# EasyEDA Pro project Tb66_and_DRV88_Teensy_LFR_PCB.epro, board Connected
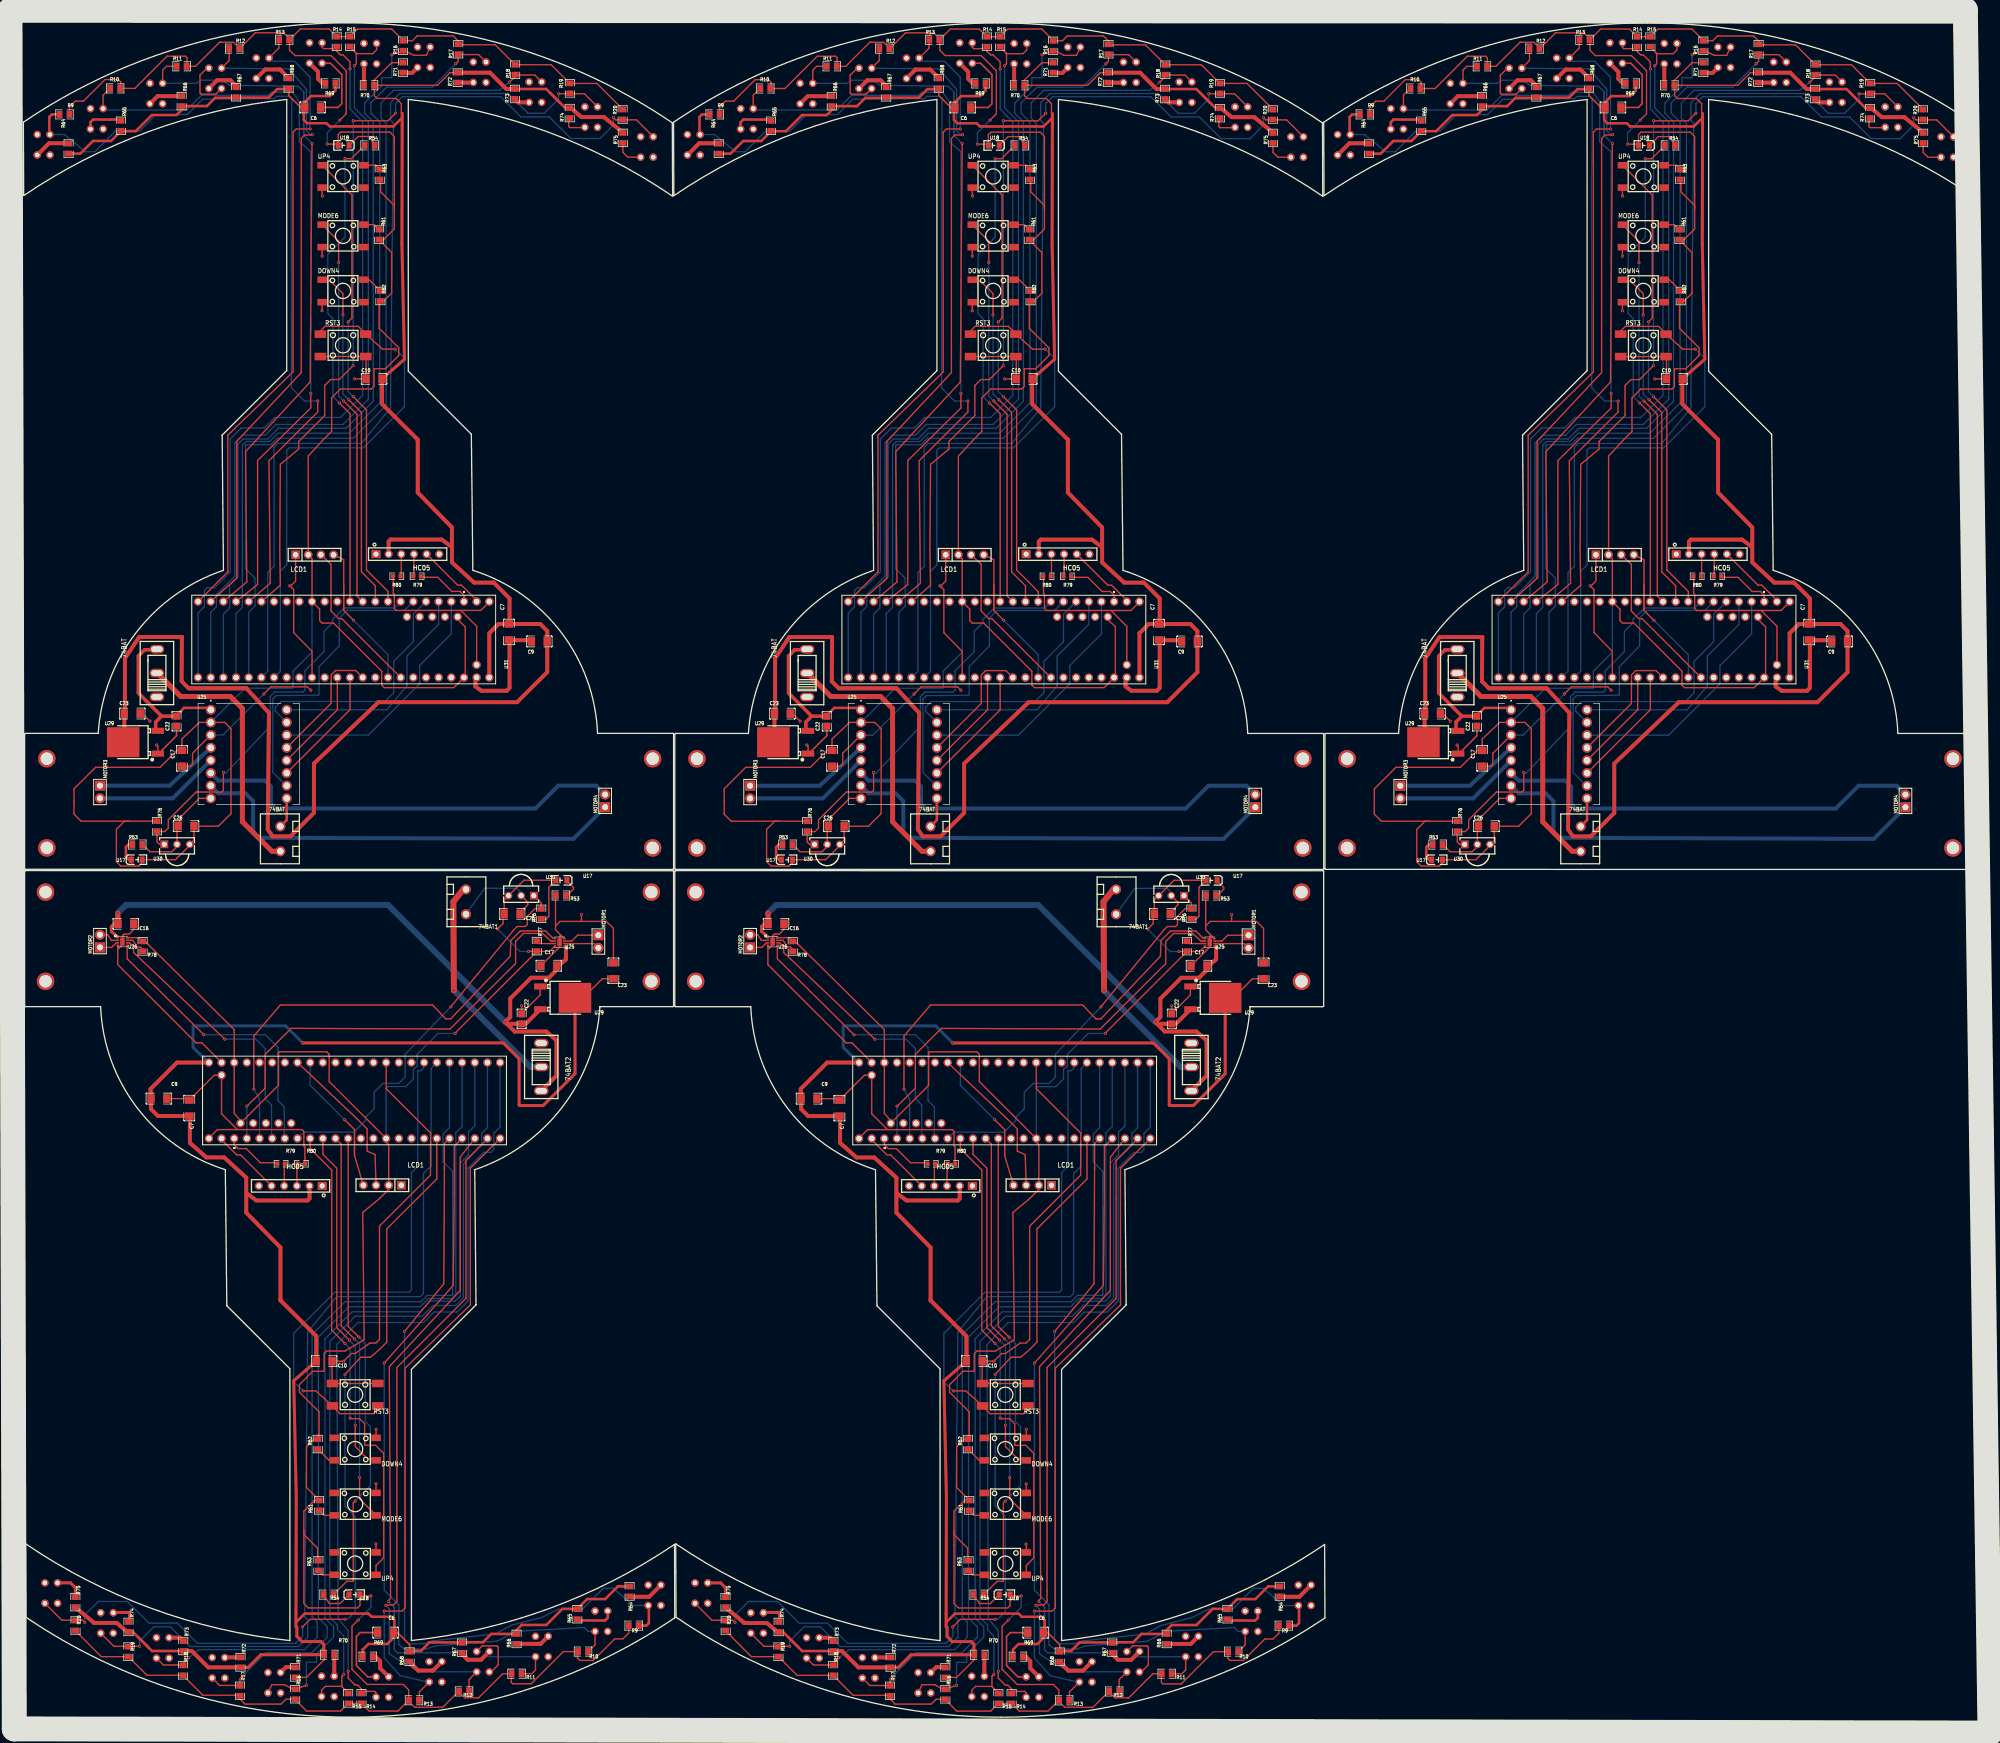
[diagram p4: board, top side]
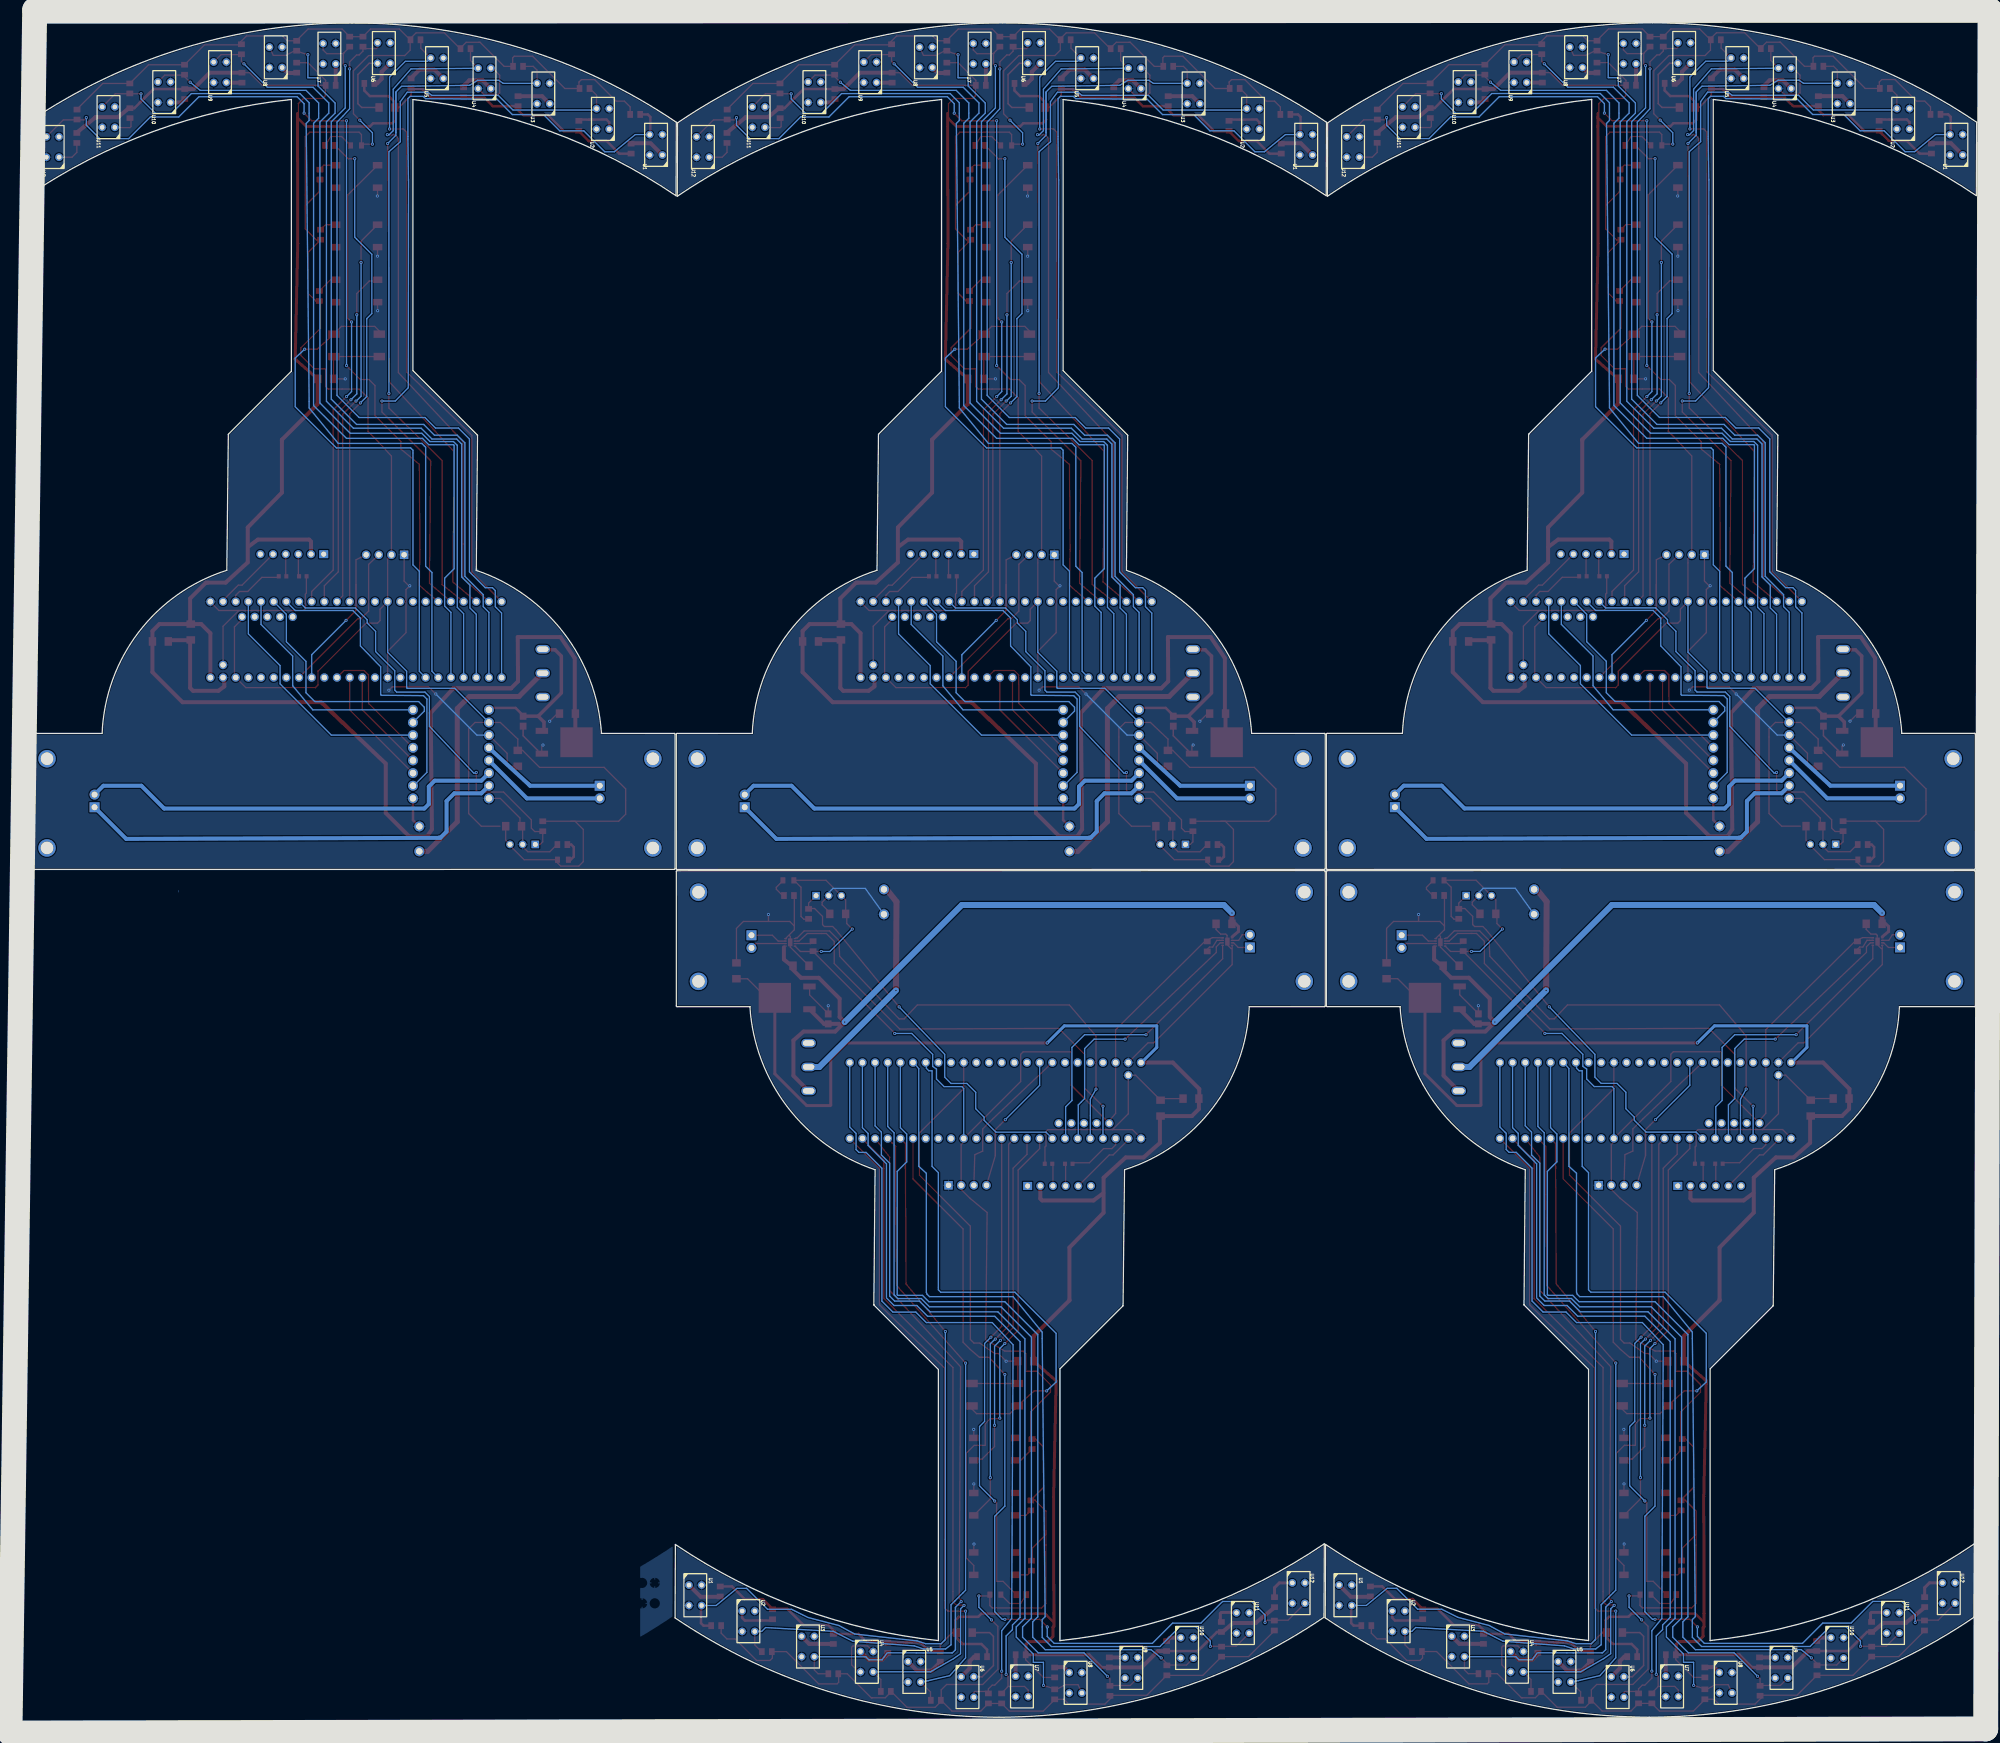
[diagram p5: board, bottom side, seen from below]

Outline 397.23 x 345.87 mm; copper layers: Top Layer, Bottom Layer. Coordinates in mm from the lower left corner of the outline.
Stack: Top Layer 0.035mm / Dielectric1 1.51mm FR4 er 4.5 / Bottom Layer 0.035mm

## Design rules (mm)
template: JLCPCB Capability(Two Layers Board)
spacing copperThickness1oz (default): track to track 0.102, other pairs 0.152 to 0.3
spacing copperThickness2oz: track to track 0.203, other pairs 0.152 to 0.3
track width copperThickness1oz (default): min 0.127, default 0.254, max 2.54
track width copperThickness2oz: min 0.203, default 0.254, max 2.54
differential pair differentialPair (default): width min 0.127, default 0.254, max 2.54; gap min 0.152, default 0.152
via viaSize (default): diameter min 0.5, default 0.61, max 10; hole min 0.3, default 0.305, max 6.3

## Placement (name value [footprint] x y rotation side)
74BAT  -  [CONN-TH_WJ126V-5.0-2P]  54.25 179.49 180 top
74BAT1  -  [CONN-TH_WJ126V-5.0-2P]  91.47 166.85 0 top
74BAT1#2  -  [CONN-TH_WJ126V-5.0-2P]  221.9 166.84 0 top
74BAT2  -  [SW-TH_SHOU-HAN_SS12D10G4]  106.58 133.7 270 top
74BAT2#2  -  [SW-TH_SHOU-HAN_SS12D10G4]  237.01 133.69 270 top
74BAT#2  -  [CONN-TH_WJ126V-5.0-2P]  184.68 179.48 180 top
74BAT#3  -  [CONN-TH_WJ126V-5.0-2P]  315.11 179.48 180 top
74BAT#4  -  [SW-TH_SHOU-HAN_SS12D10G4]  29.48 212.77 90 top
74BAT#5  -  [SW-TH_SHOU-HAN_SS12D10G4]  159.91 212.76 90 top
74BAT#6  -  [SW-TH_SHOU-HAN_SS12D10G4]  290.35 212.75 90 top
C6  -  [C1206]  60.72 326.3 180 top
C6#2  -  [C1206]  191.16 326.29 180 top
C6#3  -  [C1206]  321.59 326.29 180 top
C6#4  -  [C1206]  75.34 20.16 0 top
C6#5  -  [C1206]  205.77 20.16 0 top
C7  -  [C1206]  100.09 221.02 90 top
C7#2  -  [C1206]  230.53 221.01 90 top
C7#3  -  [C1206]  360.96 221.01 90 top
C7#4  -  [C1206]  35.97 125.45 270 top
C7#5  -  [C1206]  166.4 125.44 270 top
C9  -  [C1206]  106.19 219.12 0 top
C9#2  -  [C1206]  236.62 219.11 0 top
C9#3  -  [C1206]  367.06 219.1 0 top
C9#4  -  [C1206]  29.87 127.35 180 top
C9#5  -  [C1206]  160.3 127.34 180 top
C10  -  [C1206]  73.04 271.82 0 top
C10#2  -  [C1206]  203.48 271.81 0 top
C10#3  -  [C1206]  333.91 271.81 0 top
C10#4  -  [C1206]  63.02 74.65 180 top
C10#5  -  [C1206]  193.45 74.64 180 top
C16  -  [C1206]  23.25 162.44 180 top
C16#2  -  [C1206]  153.68 162.43 180 top
C17  -  [C1206]  34.48 195.66 90 top
C17#2  -  [C1206]  164.92 195.65 90 top
C17#3  -  [C1206]  295.35 195.65 90 top
C17#4  -  [C1206]  108.11 154.02 0 top
C17#5  -  [C1206]  238.54 154.01 0 top
C22  -  [C0805]  33.42 203.11 90 top
C22#2  -  [C0805]  163.85 203.1 90 top
C22#3  -  [C0805]  294.28 203.1 90 top
C22#4  -  [C0805]  102.64 143.35 270 top
C22#5  -  [C0805]  233.08 143.35 270 top
C23  -  [C1206]  24.53 204.64 180 top
C23#2  -  [C1206]  154.96 204.63 180 top
C23#3  -  [C1206]  285.39 204.63 180 top
C23#4  -  [C1206]  121.06 153.01 270 top
C23#5  -  [C1206]  251.49 153 270 top
C26  -  [C1206]  35.32 182.03 0 top
C26#2  -  [C1206]  165.76 182.02 0 top
C26#3  -  [C1206]  296.19 182.02 0 top
C26#4  -  [C1206]  100.74 164.44 180 top
C26#5  -  [C1206]  231.17 164.43 180 top
DOWN4  -  [KEY-SMD_4P-L6.0-W6.0-P4.50-LS9.0]  66.82 289.47 0 top
DOWN4#2  -  [KEY-SMD_4P-L6.0-W6.0-P4.50-LS9.0]  197.25 289.46 0 top
DOWN4#3  -  [KEY-SMD_4P-L6.0-W6.0-P4.50-LS9.0]  327.69 289.46 0 top
DOWN4#4  -  [KEY-SMD_4P-L6.0-W6.0-P4.50-LS9.0]  69.24 56.99 180 top
DOWN4#5  -  [KEY-SMD_4P-L6.0-W6.0-P4.50-LS9.0]  199.67 56.99 180 top
HC05  -  [HDR-TH_6P-P2.54-V-F]  79.77 236.64 0 top
HC05#2  -  [HDR-TH_6P-P2.54-V-F]  210.21 236.63 0 top
HC05#3  -  [HDR-TH_6P-P2.54-V-F]  340.64 236.63 0 top
HC05#4  -  [HDR-TH_6P-P2.54-V-F]  56.29 109.83 180 top
HC05#5  -  [HDR-TH_6P-P2.54-V-F]  186.72 109.82 180 top
LCD1  -  [HDR-TH_4P-P2.54-V-F]  61.11 236.51 0 top
LCD1#2  -  [HDR-TH_4P-P2.54-V-F]  191.54 236.5 0 top
LCD1#3  -  [HDR-TH_4P-P2.54-V-F]  321.97 236.5 0 top
LCD1#4  -  [HDR-TH_4P-P2.54-V-F]  74.7 109.95 180 top
LCD1#5  -  [HDR-TH_4P-P2.54-V-F]  205.14 109.94 180 top
MODE6  -  [KEY-SMD_4P-L6.0-W6.0-P4.50-LS9.0]  66.82 300.52 0 top
MODE6#2  -  [KEY-SMD_4P-L6.0-W6.0-P4.50-LS9.0]  197.25 300.51 0 top
MODE6#3  -  [KEY-SMD_4P-L6.0-W6.0-P4.50-LS9.0]  327.69 300.51 0 top
MODE6#4  -  [KEY-SMD_4P-L6.0-W6.0-P4.50-LS9.0]  69.24 45.95 180 top
MODE6#5  -  [KEY-SMD_4P-L6.0-W6.0-P4.50-LS9.0]  199.67 45.94 180 top
MOTOR1  -  [HDR-TH_2P-P2.54-V-M]  118.04 158.87 270 top
MOTOR1#2  -  [HDR-TH_2P-P2.54-V-M]  248.47 158.86 270 top
MOTOR2  -  [HDR-TH_2P-P2.54-V-M]  18.05 158.97 90 top
MOTOR2#2  -  [HDR-TH_2P-P2.54-V-M]  148.48 158.96 90 top
MOTOR3  -  [HDR-TH_2P-P2.54-V-M]  18.05 188.89 270 top
MOTOR3#2  -  [HDR-TH_2P-P2.54-V-M]  148.48 188.88 270 top
MOTOR3#3  -  [HDR-TH_2P-P2.54-V-M]  278.92 188.88 270 top
MOTOR4  -  [HDR-TH_2P-P2.54-V-M]  119.4 187.11 90 top
MOTOR4#2  -  [HDR-TH_2P-P2.54-V-M]  249.83 187.1 90 top
MOTOR4#3  -  [HDR-TH_2P-P2.54-V-M]  380.26 187.1 90 top
NOREF  -  [Pad_e3127]  137.82 177.66 0 top
NOREF#2  -  [Pad_e7287]  137.56 150.88 180 top
NOREF#3  -  [Pad_e2550]  128.93 177.67 0 top
NOREF#4  -  [Pad_e2548]  7.39 177.67 0 top
NOREF#5  -  [Pad_e5893]  128.67 150.89 180 top
NOREF#6  -  [Pad_e2549]  7.39 195.58 0 top
NOREF#7  -  [Pad_e4669]  389.8 177.66 0 top
NOREF#8  -  [Pad_e3128]  137.82 195.57 0 top
NOREF#9  -  [Pad_e3130]  259.36 195.57 0 top
NOREF#10  -  [Pad_e5895]  7.13 168.8 180 top
NOREF#11  -  [Pad_e2551]  128.93 195.58 0 top
NOREF#12  -  [Pad_e7285]  259.1 168.79 180 top
NOREF#13  -  [Pad_e7288]  137.56 168.79 180 top
NOREF#14  -  [Pad_e5894]  7.13 150.89 180 top
NOREF#15  -  [Pad_e7286]  259.1 150.88 180 top
NOREF#16  -  [Pad_e3129]  259.36 177.66 0 top
NOREF#17  -  [Pad_e4667]  268.26 177.66 0 top
NOREF#18  -  [Pad_e4668]  268.26 195.57 0 top
NOREF#19  -  [Pad_e4670]  389.8 195.57 0 top
NOREF#20  -  [Pad_e5892]  128.67 168.8 180 top
R9  -  [R0805]  10.94 324.91 180 top
R9#2  -  [R0805]  141.37 324.9 180 top
R9#3  -  [R0805]  271.81 324.9 180 top
R9#4  -  [R0805]  125.12 21.56 0 top
R9#5  -  [R0805]  255.55 21.55 0 top
R10  -  [R0805]  21.1 330.11 0 top
R10#2  -  [R0805]  151.53 330.1 0 top
R10#3  -  [R0805]  281.97 330.1 0 top
R10#4  -  [R0805]  114.96 16.35 180 top
R10#5  -  [R0805]  245.39 16.35 180 top
R11  -  [R0805]  34.44 334.56 0 top
R11#2  -  [R0805]  164.87 334.55 0 top
R11#3  -  [R0805]  295.3 334.55 0 top
R11#4  -  [R0805]  101.63 11.91 180 top
R11#5  -  [R0805]  232.06 11.9 180 top
R12  -  [R0805]  44.98 338.11 180 top
R12#2  -  [R0805]  175.41 338.1 180 top
R12#3  -  [R0805]  305.84 338.1 180 top
R12#4  -  [R0805]  91.09 8.35 0 top
R12#5  -  [R0805]  221.52 8.34 0 top
R13  -  [R0805]  55.01 339.89 0 top
R13#2  -  [R0805]  185.44 339.88 0 top
R13#3  -  [R0805]  315.87 339.88 0 top
R13#4  -  [R0805]  81.05 6.58 180 top
R13#5  -  [R0805]  211.49 6.57 180 top
R14  -  [R0805]  65.55 339.51 90 top
R14#2  -  [R0805]  195.98 339.5 90 top
R14#3  -  [R0805]  326.42 339.5 90 top
R14#4  -  [R0805]  70.51 6.96 270 top
R14#5  -  [R0805]  200.94 6.95 270 top
R15  -  [R0805]  68.22 339.51 270 top
R15#2  -  [R0805]  198.65 339.5 270 top
R15#3  -  [R0805]  329.08 339.5 270 top
R15#4  -  [R0805]  67.85 6.96 90 top
R15#5  -  [R0805]  198.28 6.95 90 top
R16  -  [R0805]  78.85 338.69 90 top
R16#2  -  [R0805]  209.28 338.68 90 top
R16#3  -  [R0805]  339.71 338.68 90 top
R16#4  -  [R0805]  57.22 7.78 270 top
R16#5  -  [R0805]  187.65 7.77 270 top
R17  -  [R0805]  89.93 337.99 90 top
R17#2  -  [R0805]  220.37 337.98 90 top
R17#3  -  [R0805]  350.8 337.98 90 top
R17#4  -  [R0805]  46.13 8.48 270 top
R17#5  -  [R0805]  176.56 8.47 270 top
R18  -  [R0805]  101.35 333.88 270 top
R18#2  -  [R0805]  231.78 333.87 270 top
R18#3  -  [R0805]  362.21 333.87 270 top
R18#4  -  [R0805]  34.72 12.59 90 top
R18#5  -  [R0805]  165.15 12.58 90 top
R19  -  [R0805]  112.32 330.13 90 top
R19#2  -  [R0805]  242.75 330.12 90 top
R19#3  -  [R0805]  23.74 16.34 270 top
R19#4  -  [R0805]  373.19 330.11 90 top
R19#5  -  [R0805]  154.17 16.33 270 top
R20  -  [R0805]  122.91 324.88 90 top
R20#2  -  [R0805]  253.34 324.87 90 top
R20#3  -  [R0805]  383.77 324.87 90 top
R20#4  -  [R0805]  13.15 21.58 270 top
R20#5  -  [R0805]  143.59 21.58 270 top
R53  -  [R0805]  25.55 178.35 180 top
R53#2  -  [R0805]  155.98 178.34 180 top
R53#3  -  [R0805]  286.41 178.34 180 top
R53#4  -  [R0805]  110.52 168.12 0 top
R53#5  -  [R0805]  240.95 168.11 0 top
R54  -  [R0805]  72.15 318.68 0 top
R54#2  -  [R0805]  202.59 318.67 0 top
R54#3  -  [R0805]  333.02 318.67 0 top
R54#4  -  [R0805]  63.91 27.78 180 top
R54#5  -  [R0805]  194.34 27.78 180 top
R61  -  [R0805]  74.06 300.78 270 top
R61#2  -  [R0805]  204.49 300.77 270 top
R61#3  -  [R0805]  334.92 300.77 270 top
R61#4  -  [R0805]  62 45.69 90 top
R61#5  -  [R0805]  192.44 45.68 90 top
R62  -  [R0805]  74.31 288.46 90 top
R62#2  -  [R0805]  204.75 288.45 90 top
R62#3  -  [R0805]  335.18 288.45 90 top
R62#4  -  [R0805]  61.75 58.01 270 top
R62#5  -  [R0805]  192.18 58 270 top
R63  -  [R0805]  74.19 312.84 270 top
R63#2  -  [R0805]  204.62 312.83 270 top
R63#3  -  [R0805]  335.05 312.83 270 top
R63#4  -  [R0805]  61.88 33.63 90 top
R63#5  -  [R0805]  192.31 33.62 90 top
R64  -  [R0805]  11.76 318.04 270 top
R64#2  -  [R0805]  142.19 318.03 270 top
R64#3  -  [R0805]  272.62 318.03 270 top
R64#4  -  [R0805]  124.31 28.42 90 top
R64#5  -  [R0805]  254.74 28.41 90 top
R65  -  [R0805]  22.24 322.62 270 top
R65#2  -  [R0805]  152.68 322.61 270 top
R65#3  -  [R0805]  283.11 322.61 270 top
R65#4  -  [R0805]  113.82 23.85 90 top
R65#5  -  [R0805]  244.25 23.84 90 top
R66  -  [R0805]  34.44 327.57 270 top
R66#2  -  [R0805]  164.87 327.56 270 top
R66#3  -  [R0805]  295.3 327.56 270 top
R66#4  -  [R0805]  101.63 18.89 90 top
R66#5  -  [R0805]  232.06 18.89 90 top
R67  -  [R0805]  45.36 329.35 270 top
R67#2  -  [R0805]  175.79 329.34 270 top
R67#3  -  [R0805]  306.22 329.34 270 top
R67#4  -  [R0805]  90.71 17.12 90 top
R67#5  -  [R0805]  221.14 17.11 90 top
R68  -  [R0805]  55.9 331.13 270 top
R68#2  -  [R0805]  186.33 331.12 270 top
R68#3  -  [R0805]  316.76 331.12 270 top
R68#4  -  [R0805]  80.17 15.34 90 top
R68#5  -  [R0805]  210.6 15.33 90 top
R69  -  [R0805]  64.28 331.13 0 top
R69#2  -  [R0805]  194.71 331.12 0 top
R69#3  -  [R0805]  325.15 331.12 0 top
R69#4  -  [R0805]  71.78 15.34 180 top
R69#5  -  [R0805]  202.21 15.33 180 top
R70  -  [R0805]  72.03 330.75 0 top
R70#2  -  [R0805]  202.46 330.74 0 top
R70#3  -  [R0805]  332.89 330.74 0 top
R70#4  -  [R0805]  64.04 15.72 180 top
R70#5  -  [R0805]  194.47 15.71 180 top
R71  -  [R0805]  78.85 334.3 90 top
R71#2  -  [R0805]  209.28 334.29 90 top
R71#3  -  [R0805]  339.71 334.29 90 top
R71#4  -  [R0805]  57.22 12.17 270 top
R71#5  -  [R0805]  187.65 12.16 270 top
R72  -  [R0805]  89.82 332.28 90 top
R72#2  -  [R0805]  220.25 332.27 90 top
R72#3  -  [R0805]  350.69 332.27 90 top
R72#4  -  [R0805]  46.24 14.18 270 top
R72#5  -  [R0805]  176.67 14.17 270 top
R73  -  [R0805]  101.3 329 90 top
R73#2  -  [R0805]  231.73 328.99 90 top
R73#3  -  [R0805]  362.16 328.99 90 top
R73#4  -  [R0805]  34.77 17.47 270 top
R73#5  -  [R0805]  165.2 17.46 270 top
R74  -  [R0805]  112.29 325.17 90 top
R74#2  -  [R0805]  242.72 325.16 90 top
R74#3  -  [R0805]  373.16 325.16 90 top
R74#4  -  [R0805]  23.77 21.3 270 top
R74#5  -  [R0805]  154.2 21.29 270 top
R75  -  [R0805]  122.95 320.19 90 top
R75#2  -  [R0805]  253.38 320.18 90 top
R75#3  -  [R0805]  383.82 320.18 90 top
R75#4  -  [R0805]  13.11 26.28 270 top
R75#5  -  [R0805]  143.54 26.27 270 top
R76  -  [R0805]  29.48 182.03 90 top
R76#2  -  [R0805]  159.91 182.02 90 top
R76#3  -  [R0805]  290.35 182.02 90 top
R76#4  -  [R0805]  106.58 164.44 270 top
R76#5  -  [R0805]  237.01 164.43 270 top
R77  -  [R0805]  105.69 157.96 270 top
R77#2  -  [R0805]  236.12 157.95 270 top
R78  -  [R0805]  26.61 157.9 90 top
R78#2  -  [R0805]  157.04 157.89 90 top
R79  -  [R0603]  81.68 232.2 180 top
R79#2  -  [R0603]  212.11 232.19 180 top
R79#3  -  [R0603]  342.54 232.19 180 top
R79#4  -  [R0603]  54.38 114.27 0 top
R79#5  -  [R0603]  184.82 114.26 0 top
R80  -  [R0603]  77.62 232.2 180 top
R80#2  -  [R0603]  208.05 232.19 180 top
R80#3  -  [R0603]  338.48 232.19 180 top
R80#4  -  [R0603]  58.45 114.27 0 top
R80#5  -  [R0603]  188.88 114.26 0 top
RST3  -  [SW-SMD_4P-L6.0-W6.0-P4.50-LS9.0-2]  66.82 278.55 180 top
RST3#2  -  [SW-SMD_4P-L6.0-W6.0-P4.50-LS9.0-2]  197.25 278.54 180 top
RST3#3  -  [SW-SMD_4P-L6.0-W6.0-P4.50-LS9.0-2]  327.69 278.54 180 top
RST3#4  -  [SW-SMD_4P-L6.0-W6.0-P4.50-LS9.0-2]  69.24 67.92 0 top
RST3#5  -  [SW-SMD_4P-L6.0-W6.0-P4.50-LS9.0-2]  199.67 67.91 0 top
U1  -  [OPTO-TH_4P-L8.7-W4.5-P4.10_LTH1550-01]  6.75 318.81 90 bottom
U1#2  -  [OPTO-TH_4P-L8.7-W4.5-P4.10_LTH1550-01]  137.18 318.8 90 bottom
U1#3  -  [OPTO-TH_4P-L8.7-W4.5-P4.10_LTH1550-01]  267.61 318.8 90 bottom
U1#4  -  [OPTO-TH_4P-L8.7-W4.5-P4.10_LTH1550-01]  129.31 27.66 270 bottom
U1#5  -  [OPTO-TH_4P-L8.7-W4.5-P4.10_LTH1550-01]  259.75 27.65 270 bottom
U2  -  [OPTO-TH_4P-L8.7-W4.5-P4.10_LTH1550-01]  17.42 324.02 90 bottom
U2#2  -  [OPTO-TH_4P-L8.7-W4.5-P4.10_LTH1550-01]  147.85 324.01 90 bottom
U2#3  -  [OPTO-TH_4P-L8.7-W4.5-P4.10_LTH1550-01]  278.28 324.01 90 bottom
U2#4  -  [OPTO-TH_4P-L8.7-W4.5-P4.10_LTH1550-01]  118.65 22.45 270 bottom
U2#5  -  [OPTO-TH_4P-L8.7-W4.5-P4.10_LTH1550-01]  249.08 22.44 270 bottom
U3  -  [OPTO-TH_4P-L8.7-W4.5-P4.10_LTH1550-01]  29.36 329.1 90 bottom
U3#2  -  [OPTO-TH_4P-L8.7-W4.5-P4.10_LTH1550-01]  159.79 329.09 90 bottom
U3#3  -  [OPTO-TH_4P-L8.7-W4.5-P4.10_LTH1550-01]  290.22 329.09 90 bottom
U3#4  -  [OPTO-TH_4P-L8.7-W4.5-P4.10_LTH1550-01]  106.71 17.37 270 bottom
U3#5  -  [OPTO-TH_4P-L8.7-W4.5-P4.10_LTH1550-01]  237.14 17.36 270 bottom
U4  -  [OPTO-TH_4P-L8.7-W4.5-P4.10_LTH1550-01]  41.17 332.15 90 bottom
U4#2  -  [OPTO-TH_4P-L8.7-W4.5-P4.10_LTH1550-01]  171.6 332.14 90 bottom
U4#3  -  [OPTO-TH_4P-L8.7-W4.5-P4.10_LTH1550-01]  302.03 332.13 90 bottom
U4#4  -  [OPTO-TH_4P-L8.7-W4.5-P4.10_LTH1550-01]  94.9 14.32 270 bottom
U4#5  -  [OPTO-TH_4P-L8.7-W4.5-P4.10_LTH1550-01]  225.33 14.31 270 bottom
U5  -  [OPTO-TH_4P-L8.7-W4.5-P4.10_LTH1550-01]  50.69 334.18 90 bottom
U5#2  -  [OPTO-TH_4P-L8.7-W4.5-P4.10_LTH1550-01]  181.12 334.17 90 bottom
U5#3  -  [OPTO-TH_4P-L8.7-W4.5-P4.10_LTH1550-01]  311.56 334.17 90 bottom
U5#4  -  [OPTO-TH_4P-L8.7-W4.5-P4.10_LTH1550-01]  85.37 12.29 270 bottom
U5#5  -  [OPTO-TH_4P-L8.7-W4.5-P4.10_LTH1550-01]  215.8 12.28 270 bottom
U6  -  [OPTO-TH_4P-L8.7-W4.5-P4.10_LTH1550-01]  61.36 337.23 90 bottom
U6#2  -  [OPTO-TH_4P-L8.7-W4.5-P4.10_LTH1550-01]  191.79 337.22 90 bottom
U6#3  -  [OPTO-TH_4P-L8.7-W4.5-P4.10_LTH1550-01]  322.22 337.21 90 bottom
U6#4  -  [OPTO-TH_4P-L8.7-W4.5-P4.10_LTH1550-01]  74.7 9.24 270 bottom
U6#5  -  [OPTO-TH_4P-L8.7-W4.5-P4.10_LTH1550-01]  205.14 9.23 270 bottom
U7  -  [OPTO-TH_4P-L8.7-W4.5-P4.10_LTH1550-01]  72.28 337.1 90 bottom
U7#2  -  [OPTO-TH_4P-L8.7-W4.5-P4.10_LTH1550-01]  202.71 337.09 90 bottom
U7#3  -  [OPTO-TH_4P-L8.7-W4.5-P4.10_LTH1550-01]  333.15 337.09 90 bottom
U7#4  -  [OPTO-TH_4P-L8.7-W4.5-P4.10_LTH1550-01]  63.78 9.37 270 bottom
U7#5  -  [OPTO-TH_4P-L8.7-W4.5-P4.10_LTH1550-01]  194.21 9.36 270 bottom
U8  -  [OPTO-TH_4P-L8.7-W4.5-P4.10_LTH1550-01]  83.04 336.37 90 bottom
U8#2  -  [OPTO-TH_4P-L8.7-W4.5-P4.10_LTH1550-01]  213.47 336.36 90 bottom
U8#3  -  [OPTO-TH_4P-L8.7-W4.5-P4.10_LTH1550-01]  343.9 336.36 90 bottom
U8#4  -  [OPTO-TH_4P-L8.7-W4.5-P4.10_LTH1550-01]  53.03 10.1 270 bottom
U8#5  -  [OPTO-TH_4P-L8.7-W4.5-P4.10_LTH1550-01]  183.46 10.09 270 bottom
U9  -  [OPTO-TH_4P-L8.7-W4.5-P4.10_LTH1550-01]  94.23 333.37 90 bottom
U9#2  -  [OPTO-TH_4P-L8.7-W4.5-P4.10_LTH1550-01]  224.66 333.36 90 bottom
U9#3  -  [OPTO-TH_4P-L8.7-W4.5-P4.10_LTH1550-01]  355.09 333.36 90 bottom
U9#4  -  [OPTO-TH_4P-L8.7-W4.5-P4.10_LTH1550-01]  41.84 13.1 270 bottom
U9#5  -  [OPTO-TH_4P-L8.7-W4.5-P4.10_LTH1550-01]  172.27 13.09 270 bottom
U10  -  [OPTO-TH_4P-L8.7-W4.5-P4.10_LTH1550-01]  105.41 329.37 90 bottom
U10#2  -  [OPTO-TH_4P-L8.7-W4.5-P4.10_LTH1550-01]  235.84 329.36 90 bottom
U10#3  -  [OPTO-TH_4P-L8.7-W4.5-P4.10_LTH1550-01]  366.28 329.36 90 bottom
U10#4  -  [OPTO-TH_4P-L8.7-W4.5-P4.10_LTH1550-01]  30.65 17.1 270 bottom
U10#5  -  [OPTO-TH_4P-L8.7-W4.5-P4.10_LTH1550-01]  161.08 17.09 270 bottom
U11  -  [OPTO-TH_4P-L8.7-W4.5-P4.10_LTH1550-01]  116.6 324.37 90 bottom
U11#2  -  [OPTO-TH_4P-L8.7-W4.5-P4.10_LTH1550-01]  247.03 324.36 90 bottom
U11#3  -  [OPTO-TH_4P-L8.7-W4.5-P4.10_LTH1550-01]  377.47 324.36 90 bottom
U11#4  -  [OPTO-TH_4P-L8.7-W4.5-P4.10_LTH1550-01]  19.46 22.1 270 bottom
U11#5  -  [OPTO-TH_4P-L8.7-W4.5-P4.10_LTH1550-01]  149.89 22.09 270 bottom
U12  -  [OPTO-TH_4P-L8.7-W4.5-P4.10_LTH1550-01]  127.79 318.37 90 bottom
U12#2  -  [OPTO-TH_4P-L8.7-W4.5-P4.10_LTH1550-01]  258.22 318.36 90 bottom
U12#3  -  [OPTO-TH_4P-L8.7-W4.5-P4.10_LTH1550-01]  388.65 318.36 90 bottom
U12#4  -  [OPTO-TH_4P-L8.7-W4.5-P4.10_LTH1550-01]  8.28 28.1 270 bottom
U12#5  -  [OPTO-TH_4P-L8.7-W4.5-P4.10_LTH1550-01]  138.71 28.09 270 bottom
U17  -  [LED0805-RD]  25.43 175.31 0 top
U17#2  -  [LED0805-RD]  155.86 175.3 0 top
U17#3  -  [LED0805-RD]  286.29 175.3 0 top
U17#4  -  [LED0805-RD]  110.64 171.16 180 top
U17#5  -  [LED0805-RD]  241.07 171.15 180 top
U18  -  [LED0805-RD]  66.95 318.68 180 top
U18#2  -  [LED0805-RD]  197.38 318.67 180 top
U18#3  -  [LED0805-RD]  327.81 318.67 180 top
U18#4  -  [LED0805-RD]  69.12 27.78 0 top
U18#5  -  [LED0805-RD]  199.55 27.78 0 top
U25  -  [WSON-8_L2.0-W2.0-P0.50-TL-EP]  110.26 158.72 180 top
U25#2  -  [WSON-8_L2.0-W2.0-P0.50-TL-EP]  240.7 158.71 180 top
U25#3  -  [MODULE_ROB-14450]  47.9 196.51 0 top
U25#4  -  [MODULE_ROB-14450]  178.33 196.5 0 top
U25#5  -  [MODULE_ROB-14450]  308.76 196.5 0 top
U26  -  [WSON-8_L2.0-W2.0-P0.50-TL-EP]  22.57 158.87 0 top
U26#2  -  [WSON-8_L2.0-W2.0-P0.50-TL-EP]  153 158.86 0 top
U29  -  [TO-252-3_L6.6-W6.1-P4.57-LS9.9-BR-CW]  26.18 198.89 0 top
U29#2  -  [TO-252-3_L6.6-W6.1-P4.57-LS9.9-BR-CW]  156.62 198.88 0 top
U29#3  -  [TO-252-3_L6.6-W6.1-P4.57-LS9.9-BR-CW]  287.05 198.88 0 top
U29#4  -  [TO-252-3_L6.6-W6.1-P4.57-LS9.9-BR-CW]  109.88 147.58 180 top
U29#5  -  [TO-252-3_L6.6-W6.1-P4.57-LS9.9-BR-CW]  240.31 147.57 180 top
U30  -  [OPTO-TH_3P-L7.0-W5.6-P2.54-L]  33.51 178.38 0 top
U30#2  -  [OPTO-TH_3P-L7.0-W5.6-P2.54-L]  163.95 178.37 0 top
U30#3  -  [OPTO-TH_3P-L7.0-W5.6-P2.54-L]  294.38 178.37 0 top
U30#4  -  [OPTO-TH_3P-L7.0-W5.6-P2.54-L]  102.55 168.09 180 top
U30#5  -  [OPTO-TH_3P-L7.0-W5.6-P2.54-L]  232.98 168.08 180 top
U31  -  [TEENSY41 solved]  91.08 227.12 180 top
U31#2  -  [TEENSY41 solved]  221.51 227.11 180 top
U31#3  -  [TEENSY41 solved]  351.94 227.11 180 top
U31#4  -  [TEENSY41 solved]  44.99 119.35 0 top
U31#5  -  [TEENSY41 solved]  175.42 119.34 0 top
UP4  -  [KEY-SMD_4P-L6.0-W6.0-P4.50-LS9.0]  66.82 312.46 0 top
UP4#2  -  [KEY-SMD_4P-L6.0-W6.0-P4.50-LS9.0]  197.25 312.45 0 top
UP4#3  -  [KEY-SMD_4P-L6.0-W6.0-P4.50-LS9.0]  327.69 312.45 0 top
UP4#4  -  [KEY-SMD_4P-L6.0-W6.0-P4.50-LS9.0]  69.24 34.01 180 top
UP4#5  -  [KEY-SMD_4P-L6.0-W6.0-P4.50-LS9.0]  199.67 34 180 top

## Footprints (pads in the part's own frame, mm; a bottom-side part is the same pattern mirrored in y, then rotated)
C0805
  rect 1.41x1.35 smd: 1(-1,0) 2(1,0)
C1206
  rect 1.485x1.728 smd: 1(-1.593,0) 2(1.593,0)
CONN-TH_WJ126V-5.0-2P
  round 2 hole 1.3: 1(0,2.501) 2(0,-2.501)
HDR-TH_2P-P2.54-V-M
  rect 2x2 hole 1.2: 1(-1.27,0)
  round 2 hole 1.2: 2(1.27,0)
HDR-TH_4P-P2.54-V-F
  rect 1.7x1.7 hole 1.1: 1(-3.81,0)
  round 1.7 hole 1.1: 2(-1.27,0) 3(1.27,0) 4(3.81,0)
HDR-TH_6P-P2.54-V-F
  rect 1.8x1.6 hole 1.02: 1(-6.35,0)
  round 1.6 hole 1.02: 2(-3.81,0) 3(-1.27,0) 4(1.27,0) 5(3.81,0) 6(6.35,0)
KEY-SMD_4P-L6.0-W6.0-P4.50-LS9.0
  rect 1.9x1.3 smd: 1(-4.2,2.25) 2(4.2,2.25) 3(-4.2,-2.25) 4(4.2,-2.25)
LED0805-RD
  rect 1x1.25 smd: 1(-1.1,0) 2(1.1,0)
MODULE_ROB-14450
  round 1.98 hole 1.32: 1(-7.62,8.89) 2(-7.62,6.35) 3(-7.62,3.81) 4(-7.62,1.27) 5(-7.62,-1.27) 6(-7.62,-3.81) 7(-7.62,-6.35) 8(-7.62,-8.89) 9(7.62,-8.89) 10(7.62,-6.35) 11(7.62,-3.81) 12(7.62,-1.27) 13(7.62,1.27) 14(7.62,3.81) 15(7.62,6.35) 16(7.62,8.89)
OPTO-TH_3P-L7.0-W5.6-P2.54-L
  rect 1.524x1.524 hole 1: 1(-2.54,0)
  round 1.524 hole 1: 2(0,0) 3(2.54,0)
OPTO-TH_4P-L8.7-W4.5-P4.10_LTH1550-01
  round 1.524 hole 0.914: 1(-2.05,1.27) 2(2.05,1.27) 3(-2.05,-1.27) 4(2.05,-1.27)
Pad_e2548
  round 3.5 hole 2.5: 1(0,0)
Pad_e2549
  round 3.5 hole 2.5: 1(0,0)
Pad_e2550
  round 3.5 hole 2.5: 2(0,0)
Pad_e2551
  round 3.5 hole 2.5: 1(0,0)
Pad_e3127
  round 3.5 hole 2.5: 1(0,0)
Pad_e3128
  round 3.5 hole 2.5: 1(0,0)
Pad_e3129
  round 3.5 hole 2.5: 2(0,0)
Pad_e3130
  round 3.5 hole 2.5: 1(0,0)
Pad_e4667
  round 3.5 hole 2.5: 1(0,0)
Pad_e4668
  round 3.5 hole 2.5: 1(0,0)
Pad_e4669
  round 3.5 hole 2.5: 2(0,0)
Pad_e4670
  round 3.5 hole 2.5: 1(0,0)
Pad_e5892
  round 3.5 hole 2.5: 1(0,0)
Pad_e5893
  round 3.5 hole 2.5: 1(0,0)
Pad_e5894
  round 3.5 hole 2.5: 1(0,0)
Pad_e5895
  round 3.5 hole 2.5: 2(0,0)
Pad_e7285
  round 3.5 hole 2.5: 1(0,0)
Pad_e7286
  round 3.5 hole 2.5: 1(0,0)
Pad_e7287
  round 3.5 hole 2.5: 1(0,0)
Pad_e7288
  round 3.5 hole 2.5: 2(0,0)
R0603
  rect 0.806x0.864 smd: 1(-0.753,0) 2(0.753,0)
R0805
  rect 1.133x1.377 smd: 1(-1,0) 2(1,0)
SW-SMD_4P-L6.0-W6.0-P4.50-LS9.0-2
  rect 2.3x1.5 smd: 1(-4.55,2.25) 2(4.55,2.25) 3(-4.55,-2.25) 4(4.55,-2.25)
SW-TH_SHOU-HAN_SS12D10G4
  oval 1.7x2.9 hole 1.1x2.3: 1(-4.8,0) 2(0,0) 3(4.8,0)
TEENSY41 solved
  round 1.665 hole 1.11: 0(-2.54,0) 1(0,0) 2(2.54,0) 3(5.08,0) 4(7.62,0) 5(10.16,0) 6(12.7,0) 7(15.24,0) 8(17.78,0) 9(20.32,0) 10(22.86,0) 11(25.4,0) 12(27.94,0) 13(27.94,15.24) 14(25.4,15.24) 15(22.86,15.24) 16(20.32,15.24) 17(17.78,15.24) 18(15.24,15.24) 19(12.7,15.24) 20(10.16,15.24) 21(7.62,15.24) 22(5.08,15.24) 23(2.54,15.24) 24(33.02,0) 25(35.56,0) 26(38.1,0) 27(40.64,0) 28(43.18,0) 29(45.72,0) 30(48.26,0) 31(50.8,0) 32(53.34,0) 33(53.34,15.24) 33V(0,15.24) 33V(30.48,0) 34(50.8,15.24) 35(48.26,15.24) 36(45.72,15.24) 37(43.18,15.24) 38(40.64,15.24) 39(38.1,15.24) 40(35.56,15.24) 41(33.02,15.24) 48(11.43,3.05) 49(8.89,3.05) 50(6.35,3.05) 51(3.81,3.05) 52(1.27,3.05) GND(-5.08,0) GND1(-2.54,15.24) GND2(-2.54,12.7) GND3(30.48,15.24) VIN1(-5.08,15.24)
TO-252-3_L6.6-W6.1-P4.57-LS9.9-BR-CW
  rect 2.5x1.2 smd: 1(3.475,-2.286) 3(3.475,2.286)
  rect 6.5x6 smd: 2(-3.475,0)
WSON-8_L2.0-W2.0-P0.50-TL-EP
  rect 0.521x0.25 smd: 1(-0.95,0.75) 2(-0.95,0.25) 3(-0.95,-0.25) 4(-0.95,-0.75) 5(0.95,-0.75) 6(0.95,-0.25) 7(0.95,0.25) 8(0.95,0.75)
  rect 0.9x1.6 smd: 9(0,0)

## Nets
+3.3V: C17.2 C17#2.2 C17#3.2 C26.2 C26#2.2 C26#3.2 C26#4.2 C26#5.2 LCD1.2 LCD1#2.2 LCD1#3.2 LCD1#4.2 LCD1#5.2 R9.1 R9#2.1 R9#3.1 R9#4.1 R9#5.1 R10.2 R10#2.2 R10#3.2 R10#4.2 R10#5.2 R11.2 R11#2.2 R11#3.2 R11#4.2 R11#5.2 R12.1 R12#2.1 R12#3.1 R12#4.1 R12#5.1 R13.2 R13#2.2 R13#3.2 R13#4.2 R13#5.2 R14.2 R14#2.2 R14#3.2 R14#4.2 R14#5.2 R15.1 R15#2.1 R15#3.1 R15#4.1 R15#5.1 R16.2 R16#2.2 R16#3.2 R16#4.2 R16#5.2 R17.2 R17#2.2 R17#3.2 R17#4.2 R17#5.2 R18.1 R18#2.1 R18#3.1 R18#4.1 R18#5.1 R19.2 R19#2.2 R19#3.2 R19#4.2 R19#5.2 R20.2 R20#2.2 R20#3.2 R20#4.2 R20#5.2 R61.2 R61#2.2 R61#3.2 R61#4.2 R61#5.2 R62.1 R62#2.1 R62#3.1 R62#4.1 R62#5.1 R63.2 R63#2.2 R63#3.2 R63#4.2 R63#5.2 R76.2 R76#2.2 R76#3.2 R76#4.2 R76#5.2 R77.2 R77#2.2 R78.2 R78#2.2 U17.2 U17#2.2 U17#3.2 U17#4.2 U17#5.2 U18.2 U18#2.2 U18#3.2 U18#4.2 U18#5.2 U25.8 U25#2.8 U25#3.2 U25#4.2 U25#5.2 U26.8 U26#2.8 U30.3 U30#2.3 U30#3.3 U30#4.3 U30#5.3 U31.33V U31.52 U31#2.33V U31#2.52 U31#3.33V U31#3.52 U31#4.33V U31#4.52 U31#5.33V U31#5.52
+5V: C6.2 C6#2.2 C6#3.2 C6#4.2 C6#5.2 C7.2 C7#2.2 C7#3.2 C7#4.2 C7#5.2 C9.2 C9#2.2 C9#3.2 C9#4.2 C9#5.2 C10.2 C10#2.2 C10#3.2 C10#4.2 C10#5.2 C23.2 C23#2.2 C23#3.2 C23#4.2 C23#5.2 HC05.2 HC05#2.2 HC05#3.2 HC05#4.2 HC05#5.2 R64.2 R64#2.2 R64#3.2 R64#4.2 R64#5.2 R65.2 R65#2.2 R65#3.2 R65#4.2 R65#5.2 R66.2 R66#2.2 R66#3.2 R66#4.2 R66#5.2 R67.2 R67#2.2 R67#3.2 R67#4.2 R67#5.2 R68.2 R68#2.2 R68#3.2 R68#4.2 R68#5.2 R69.2 R69#2.2 R69#3.2 R69#4.2 R69#5.2 R70.2 R70#2.2 R70#3.2 R70#4.2 R70#5.2 R71.2 R71#2.2 R71#3.2 R71#4.2 R71#5.2 R72.2 R72#2.2 R72#3.2 R72#4.2 R72#5.2 R73.2 R73#2.2 R73#3.2 R73#4.2 R73#5.2 R74.2 R74#2.2 R74#3.2 R74#4.2 R74#5.2 R75.2 R75#2.2 R75#3.2 R75#4.2 R75#5.2 U29.2 U29#2.2 U29#3.2 U29#4.2 U29#5.2 U31.VIN1 U31#2.VIN1 U31#3.VIN1 U31#4.VIN1 U31#5.VIN1
+7.4V: 74BAT2.3 74BAT2#2.3 74BAT#4.3 74BAT#5.3 74BAT#6.3 C16.2 C16#2.2 C17#4.2 C17#5.2 C22.2 C22#2.2 C22#3.2 C22#4.2 C22#5.2 U25.1 U25#2.1 U25#3.1 U25#4.1 U25#5.1 U26.1 U26#2.1 U29.3 U29#2.3 U29#3.3 U29#4.3 U29#5.3
GND: 74BAT.2 74BAT1.2 74BAT1#2.2 74BAT#2.2 74BAT#3.2 C6.1 C6#2.1 C6#3.1 C6#4.1 C6#5.1 C7.1 C7#2.1 C7#3.1 C7#4.1 C7#5.1 C9.1 C9#2.1 C9#3.1 C9#4.1 C9#5.1 C10.1 C10#2.1 C10#3.1 C10#4.1 C10#5.1 C16.1 C16#2.1 C17.1 C17#2.1 C17#3.1 C17#4.1 C17#5.1 C22.1 C22#2.1 C22#3.1 C22#4.1 C22#5.1 C23.1 C23#2.1 C23#3.1 C23#4.1 C23#5.1 C26.1 C26#2.1 C26#3.1 C26#4.1 C26#5.1 DOWN4.3 DOWN4#2.3 DOWN4#3.3 DOWN4#4.3 DOWN4#5.3 LCD1.1 LCD1#2.1 LCD1#3.1 LCD1#4.1 LCD1#5.1 MODE6.3 MODE6#2.3 MODE6#3.3 MODE6#4.3 MODE6#5.3 R53.1 R53#2.1 R53#3.1 R53#4.1 R53#5.1 R80.2 R80#2.2 R80#3.2 R80#4.2 R80#5.2 RST3.1 RST3.2 RST3#2.1 RST3#2.2 RST3#3.1 RST3#3.2 RST3#4.1 RST3#4.2 RST3#5.1 RST3#5.2 U1.1 U1.4 U1#2.1 U1#2.4 U1#3.1 U1#3.4 U1#4.1 U1#4.4 U1#5.1 U1#5.4 U2.1 U2.4 U2#2.1 U2#2.4 U2#3.1 U2#3.4 U2#4.1 U2#4.4 U2#5.1 U2#5.4 U3.1 U3.4 U3#2.1 U3#2.4 U3#3.1 U3#3.4 U3#4.1 U3#4.4 U3#5.1 U3#5.4 U4.1 U4.4 U4#2.1 U4#2.4 U4#3.1 U4#3.4 U4#4.1 U4#4.4 U4#5.1 U4#5.4 U5.1 U5.4 U5#2.1 U5#2.4 U5#3.1 U5#3.4 U5#4.1 U5#4.4 U5#5.1 U5#5.4 U6.1 U6.4 U6#2.1 U6#2.4 U6#3.1 U6#3.4 U6#4.1 U6#4.4 U6#5.1 U6#5.4 U7.1 U7.4 U7#2.1 U7#2.4 U7#3.1 U7#3.4 U7#4.1 U7#4.4 U7#5.1 U7#5.4 U8.1 U8.4 U8#2.1 U8#2.4 U8#3.1 U8#3.4 U8#4.1 U8#4.4 U8#5.1 U8#5.4 U9.1 U9.4 U9#2.1 U9#2.4 U9#3.1 U9#3.4 U9#4.1 U9#4.4 U9#5.1 U9#5.4 U10.1 U10.4 U10#2.1 U10#2.4 U10#3.1 U10#3.4 U10#4.1 U10#4.4 U10#5.1 U10#5.4 U11.1 U11.4 U11#2.1 U11#2.4 U11#3.1 U11#3.4 U11#4.1 U11#4.4 U11#5.1 U11#5.4 U12.1 U12.4 U12#2.1 U12#2.4 U12#3.1 U12#3.4 U12#4.1 U12#4.4 U12#5.1 U12#5.4 U25.4 U25.9 U25#2.4 U25#2.9 U25#3.3 U25#3.8 U25#3.9 U25#4.3 U25#4.8 U25#4.9 U25#5.3 U25#5.8 U25#5.9 U26.4 U26.9 U26#2.4 U26#2.9 U29.1 U29#2.1 U29#3.1 U29#4.1 U29#5.1 U30.2 U30#2.2 U30#3.2 U30#4.2 U30#5.2 U31.GND U31.GND1 U31.GND2 U31.GND3 U31#2.GND U31#2.GND1 U31#2.GND2 U31#2.GND3 U31#3.GND U31#3.GND1 U31#3.GND2 U31#3.GND3 U31#4.GND U31#4.GND1 U31#4.GND2 U31#4.GND3 U31#5.GND U31#5.GND1 U31#5.GND2 U31#5.GND3 UP4.3 UP4#2.3 UP4#3.3 UP4#4.3 UP4#5.3
7: U31.7 U31#2.7 U31#3.7 U31#4.7 U31#5.7 UP4.1 UP4#2.1 UP4#3.1 UP4#4.1 UP4#5.1
8: DOWN4.1 DOWN4#2.1 DOWN4#3.1 DOWN4#4.1 DOWN4#5.1 U31.8 U31#2.8 U31#3.8 U31#4.8 U31#5.8
9: MODE6.1 MODE6#2.1 MODE6#3.1 MODE6#4.1 MODE6#5.1 U31.9 U31#2.9 U31#3.9 U31#4.9 U31#5.9
10: R54.1 R54#2.1 R54#3.1 R54#4.1 R54#5.1 U31.10 U31#2.10 U31#3.10 U31#4.10 U31#5.10
27(A11): R20.1 R20#2.1 R20#3.1 R20#4.1 R20#5.1 U12.2 U12#2.2 U12#3.2 U12#4.2 U12#5.2 U31.27 U31#2.27 U31#3.27 U31#4.27 U31#5.27
28(A0): R9.2 R9#2.2 R9#3.2 R9#4.2 R9#5.2 U1.2 U1#2.2 U1#3.2 U1#4.2 U1#5.2 U31.28 U31#2.28 U31#3.28 U31#4.28 U31#5.28
29(A1): R10.1 R10#2.1 R10#3.1 R10#4.1 R10#5.1 U2.2 U2#2.2 U2#3.2 U2#4.2 U2#5.2 U31.29 U31#2.29 U31#3.29 U31#4.29 U31#5.29
30(A2): R11.1 R11#2.1 R11#3.1 R11#4.1 R11#5.1 U3.2 U3#2.2 U3#3.2 U3#4.2 U3#5.2 U31.30 U31#2.30 U31#3.30 U31#4.30 U31#5.30
31(A3): R12.2 R12#2.2 R12#3.2 R12#4.2 R12#5.2 U4.2 U4#2.2 U4#3.2 U4#4.2 U4#5.2 U31.31 U31#2.31 U31#3.31 U31#4.31 U31#5.31
32(A4): R13.1 R13#2.1 R13#3.1 R13#4.1 R13#5.1 U5.2 U5#2.2 U5#3.2 U5#4.2 U5#5.2 U31.32 U31#2.32 U31#3.32 U31#4.32 U31#5.32
33(A5): R14.1 R14#2.1 R14#3.1 R14#4.1 R14#5.1 U6.2 U6#2.2 U6#3.2 U6#4.2 U6#5.2 U31.33 U31#2.33 U31#3.33 U31#4.33 U31#5.33
34(A6): R15.2 R15#2.2 R15#3.2 R15#4.2 R15#5.2 U7.2 U7#2.2 U7#3.2 U7#4.2 U7#5.2 U31.34 U31#2.34 U31#3.34 U31#4.34 U31#5.34
35(A7): R16.1 R16#2.1 R16#3.1 R16#4.1 R16#5.1 U8.2 U8#2.2 U8#3.2 U8#4.2 U8#5.2 U31.35 U31#2.35 U31#3.35 U31#4.35 U31#5.35
36(A8): R17.1 R17#2.1 R17#3.1 R17#4.1 R17#5.1 U9.2 U9#2.2 U9#3.2 U9#4.2 U9#5.2 U31.36 U31#2.36 U31#3.36 U31#4.36 U31#5.36
37(A9): R18.2 R18#2.2 R18#3.2 R18#4.2 R18#5.2 U10.2 U10#2.2 U10#3.2 U10#4.2 U10#5.2 U31.37 U31#2.37 U31#3.37 U31#4.37 U31#5.37
38(A10): R19.1 R19#2.1 R19#3.1 R19#4.1 R19#5.1 U11.2 U11#2.2 U11#3.2 U11#4.2 U11#5.2 U31.38 U31#2.38 U31#3.38 U31#4.38 U31#5.38
BTRX(0): HC05.5 HC05#2.5 HC05#3.5 HC05#4.5 HC05#5.5 U31.0 U31#2.0 U31#3.0 U31#4.0 U31#5.0
BTTX(1): R79.1 R79#2.1 R79#3.1 R79#4.1 R79#5.1 U31.1 U31#2.1 U31#3.1 U31#4.1 U31#5.1
DIR-A(2): U25#3.14 U25#4.14 U25#5.14 U31.2 U31#2.2 U31#3.2
DIR-A(4): U25#3.15 U25#4.15 U25#5.15 U31.4 U31#2.4 U31#3.4
DIR-B(14): U25#3.12 U25#4.12 U25#5.12 U31.14 U31#2.14 U31#3.14
DIR-B(15): U25#3.11 U25#4.11 U25#5.11 U31.15 U31#2.15 U31#3.15
IRSIGNAL_IN(6): R76.1 R76#2.1 R76#3.1 R76#4.1 R76#5.1 U30.1 U30#2.1 U30#3.1 U30#4.1 U30#5.1 U31.6 U31#2.6 U31#3.6 U31#4.6 U31#5.6
M1P(2): U25.6 U25#2.6 U31#4.2 U31#5.2
M1S(3): U25.5 U25#2.5 U31#4.3 U31#5.3
M1SLEEP(3.3V): R77.1 R77#2.1 U25.7 U25#2.7
M2P(4): U26.6 U26#2.6 U31#4.4 U31#5.4
M2S(5): U26.5 U26#2.5 U31#4.5 U31#5.5
M2SLEEP(3.3V): R78.1 R78#2.1 U26.7 U26#2.7
ON/OFF: U31.49 U31#2.49 U31#3.49 U31#4.49 U31#5.49
PWM(3): U25#3.16 U25#4.16 U25#5.16 U31.3 U31#2.3 U31#3.3
PWM(5): U25#3.10 U25#4.10 U25#5.10 U31.5 U31#2.5 U31#3.5
RESET: RST3.3 RST3.4 RST3#2.3 RST3#2.4 RST3#3.3 RST3#3.4 RST3#4.3 RST3#4.4 RST3#5.3 RST3#5.4 U31.39 U31#2.39 U31#3.39 U31#4.39 U31#5.39
SCL(19): LCD1.3 LCD1#2.3 LCD1#3.3 LCD1#4.3 LCD1#5.3 U31.19 U31#2.19 U31#3.19 U31#4.19 U31#5.19
SDA(18): LCD1.4 LCD1#2.4 LCD1#3.4 LCD1#4.4 LCD1#5.4 U31.18 U31#2.18 U31#3.18 U31#4.18 U31#5.18
STANDYB-CONTROL(16): U25#3.13 U25#4.13 U25#5.13 U31.16 U31#2.16 U31#3.16
$1N4606: R68.1 R68#2.1 R68#3.1 U5.3 U5#2.3 U5#3.3
$1N4607: R67.1 R67#2.1 R67#3.1 U4.3 U4#2.3 U4#3.3
$1N4618: R65.1 R65#2.1 R65#3.1 U2.3 U2#2.3 U2#3.3
$1N4619: R66.1 R66#2.1 R66#3.1 U3.3 U3#2.3 U3#3.3
$1N4626: R64.1 R64#2.1 R64#3.1 U1.3 U1#2.3 U1#3.3
$1N4631: HC05.4 HC05#2.4 HC05#3.4 R79.2 R79#2.2 R79#3.2
$1N4632: HC05.3 HC05#2.3 HC05#3.3 R80.1 R80#2.1 R80#3.1
$1N4662: R63.1 R63#2.1 R63#3.1 UP4.2 UP4#2.2 UP4#3.2
$1N4664: DOWN4.2 DOWN4#2.2 DOWN4#3.2 R62.2 R62#2.2 R62#3.2
$1N4665: MODE6.2 MODE6#2.2 MODE6#3.2 R61.1 R61#2.1 R61#3.1
$1N4672: R54.2 R54#2.2 R54#3.2 U18.1 U18#2.1 U18#3.1
$1N4684: R73.1 R73#2.1 R73#3.1 U10.3 U10#2.3 U10#3.3
$1N4685: R74.1 R74#2.1 R74#3.1 U11.3 U11#2.3 U11#3.3
$1N4686: R75.1 R75#2.1 R75#3.1 U12.3 U12#2.3 U12#3.3
$1N4698: R71.1 R71#2.1 R71#3.1 U8.3 U8#2.3 U8#3.3
$1N4699: R72.1 R72#2.1 R72#3.1 U9.3 U9#2.3 U9#3.3
$1N4706: R69.1 R69#2.1 R69#3.1 U6.3 U6#2.3 U6#3.3
$1N4711: 74BAT.1 74BAT#2.1 74BAT#3.1 74BAT#4.2 74BAT#5.2 74BAT#6.2
$1N4716: R53.2 R53#2.2 R53#3.2 U17.1 U17#2.1 U17#3.1
$1N5383: MOTOR4.2 MOTOR4#2.2 MOTOR4#3.2 U25#3.6 U25#4.6 U25#5.6
$1N5385: MOTOR4.1 MOTOR4#2.1 MOTOR4#3.1 U25#3.7 U25#4.7 U25#5.7
$1N5399: MOTOR3.1 MOTOR3#2.1 MOTOR3#3.1 U25#3.4 U25#4.4 U25#5.4
$1N5401: MOTOR3.2 MOTOR3#2.2 MOTOR3#3.2 U25#3.5 U25#4.5 U25#5.5
$1N10466: R70.1 R70#2.1 R70#3.1 U7.3 U7#2.3 U7#3.3
$1N12804: R68#4.1 R68#5.1 U5#4.3 U5#5.3
$1N12805: R67#4.1 R67#5.1 U4#4.3 U4#5.3
$1N12816: R65#4.1 R65#5.1 U2#4.3 U2#5.3
$1N12817: R66#4.1 R66#5.1 U3#4.3 U3#5.3
$1N12824: R64#4.1 R64#5.1 U1#4.3 U1#5.3
$1N12829: HC05#4.4 HC05#5.4 R79#4.2 R79#5.2
$1N12830: HC05#4.3 HC05#5.3 R80#4.1 R80#5.1
$1N12842: R63#4.1 R63#5.1 UP4#4.2 UP4#5.2
$1N12844: DOWN4#4.2 DOWN4#5.2 R62#4.2 R62#5.2
$1N12845: MODE6#4.2 MODE6#5.2 R61#4.1 R61#5.1
$1N12852: R54#4.2 R54#5.2 U18#4.1 U18#5.1
$1N12862: R73#4.1 R73#5.1 U10#4.3 U10#5.3
$1N12863: R74#4.1 R74#5.1 U11#4.3 U11#5.3
$1N12864: R75#4.1 R75#5.1 U12#4.3 U12#5.3
$1N12875: R71#4.1 R71#5.1 U8#4.3 U8#5.3
$1N12876: R72#4.1 R72#5.1 U9#4.3 U9#5.3
$1N12883: R69#4.1 R69#5.1 U6#4.3 U6#5.3
$1N12886: 74BAT1.1 74BAT1#2.1 74BAT2.2 74BAT2#2.2
$1N12898: R53#4.2 R53#5.2 U17#4.1 U17#5.1
$1N12918: R70#4.1 R70#5.1 U7#4.3 U7#5.3
$1N15829: MOTOR1.2 MOTOR1#2.2 U25.2 U25#2.2
$1N15830: MOTOR1.1 MOTOR1#2.1 U25.3 U25#2.3
$1N16024: MOTOR2.2 MOTOR2#2.2 U26.2 U26#2.2
$1N16025: MOTOR2.1 MOTOR2#2.1 U26.3 U26#2.3

Pads without a net: 74BAT2 1; 74BAT2#2 1; 74BAT#4 1; 74BAT#5 1; 74BAT#6 1; DOWN4 4; DOWN4#2 4; DOWN4#3 4; DOWN4#4 4; DOWN4#5 4; HC05 1 6; HC05#2 1 6; HC05#3 1 6; HC05#4 1 6; HC05#5 1 6; MODE6 4; MODE6#2 4; MODE6#3 4; MODE6#4 4; MODE6#5 4; NOREF 1; NOREF#2 1; NOREF#3 2; NOREF#4 1; NOREF#5 1; NOREF#6 1; NOREF#7 2; NOREF#8 1; NOREF#9 1; NOREF#10 2; NOREF#11 1; NOREF#12 1; NOREF#13 2; NOREF#14 1; NOREF#15 1; NOREF#16 2; NOREF#17 1; NOREF#18 1; NOREF#19 1; NOREF#20 1; U31 11 12 13 17 20 21 22 23 24 25 26 40 41 48 50 51; U31#2 11 12 13 17 20 21 22 23 24 25 26 40 41 48 50 51; U31#3 11 12 13 17 20 21 22 23 24 25 26 40 41 48 50 51; U31#4 11 12 13 14 15 16 17 20 21 22 23 24 25 26 40 41 48 50 51; U31#5 11 12 13 14 15 16 17 20 21 22 23 24 25 26 40 41 48 50 51; UP4 4; UP4#2 4; UP4#3 4; UP4#4 4; UP4#5 4

## Via types
v1: diameter 0.61, hole 0.305, Top Layer to Bottom Layer, 201 vias

## Routing (per net, layer and track width the routed paths; a pad name or vN(x,y) marks a point on that pad's centre or on a via; arc(x,y) is an arc through that point)
+3.3V:
  vias: v1(63.65,318.94) v1(66.19,323.76) v1(69.88,22.7) v1(72.42,27.52) v1(89.31,140.43) v1(97.82,161.39) v1(104.04,156.88) v1(194.08,318.93) v1(196.62,323.75) v1(200.31,22.7) v1(202.85,27.52) v1(219.74,140.42) v1(228.25,161.38) v1(234.47,156.88) v1(324.51,318.93) v1(327.05,323.75)
+5V:
  vias: v1(58.7,138.53) v1(189.13,138.52)
+7.4V:
  vias: v1(21.65,164.6) v1(99.34,142.72) v1(152.09,164.59) v1(229.77,142.71)
GND:
  vias: v1(28.09,203.11) v1(29.43,198.33) v1(50.95,208.57) v1(56.15,230.29) v1(60.34,209.34) v1(62.66,308.53) v1(62.63,296.46) v1(62.6,285.5) v1(66.96,74.65) v1(69.11,271.82) v1(73.46,60.97) v1(73.43,50.01) v1(73.41,37.94) v1(102.64,145.99) v1(114.64,164.31) v1(158.52,203.1) v1(159.87,198.32) v1(181.38,208.56) v1(186.58,230.28) v1(190.78,209.33) v1(193.06,296.45) v1(193.03,285.49) v1(193.09,308.52) v1(197.39,74.64) v1(199.54,271.81) v1(203.84,37.93) v1(203.89,60.96) v1(203.87,50) v1(233.08,145.98) v1(245.07,164.3) v1(288.95,203.1) v1(290.3,198.32) v1(311.81,208.56) v1(317.02,230.28) v1(321.21,209.33) v1(323.52,308.52) v1(323.49,296.45) v1(323.47,285.49) v1(329.97,271.81)
7:
  vias: v1(67.21,78.2) v1(67.84,283.25) v1(68.23,63.22) v1(68.85,268.26) v1(197.64,78.19) v1(198.27,283.24) v1(198.66,63.21) v1(199.28,268.25) v1(328.7,283.24) v1(329.72,268.25)
8:
  vias: v1(66.79,284.7) v1(67.96,267.63) v1(68.1,78.84) v1(69.28,61.77) v1(197.22,284.69) v1(198.4,267.62) v1(198.53,78.83) v1(199.71,61.76) v1(327.65,284.68) v1(328.83,267.62)
9:
  vias: v1(65.93,295.19) v1(66.95,267.38) v1(69.12,79.09) v1(70.13,51.28) v1(196.36,295.18) v1(197.38,267.37) v1(199.55,79.08) v1(200.56,51.27) v1(326.8,295.18) v1(327.81,267.36)
10:
  vias: v1(66.06,267) v1(67.2,316.02) v1(69.24,46.58) v1(70.01,79.47) v1(196.49,266.99) v1(197.63,316.01) v1(199.67,46.57) v1(200.44,79.46) v1(326.92,266.99) v1(328.07,316.01)
27(A11):
  vias: v1(15.01,22.2) v1(58.7,21.31) v1(67.21,71.98) v1(67.21,22.83) v1(68.85,323.64) v1(68.85,274.49) v1(77.36,325.16) v1(121.05,324.27) v1(145.45,22.19) v1(189.13,21.3) v1(197.64,71.97) v1(197.64,22.82) v1(199.28,323.63) v1(199.28,274.48) v1(207.79,325.15) v1(251.48,324.26) v1(329.72,323.63) v1(329.72,274.48) v1(338.23,325.15) v1(381.91,324.26)
28(A0):
  vias: v1(61.74,267.38) v1(79.15,80.62) v1(192.17,267.37) v1(209.58,80.61) v1(322.61,267.36)
29(A1):
  vias: v1(60.34,268.9) v1(75.09,74.27) v1(190.78,268.89) v1(205.52,74.26) v1(321.21,268.89)
30(A2):
  vias: v1(60.6,319.06) v1(75.97,26.39) v1(191.03,319.05) v1(206.41,26.38) v1(321.46,319.05)
31(A3):
  vias: v1(60.66,320.84) v1(75.4,25.63) v1(191.09,320.83) v1(205.83,25.62) v1(321.53,320.83)
32(A4):
  vias: v1(60.22,321.99) v1(75.09,24.48) v1(190.65,321.98) v1(205.52,24.47) v1(321.08,321.97)
33(A5):
  vias: v1(67.85,12.42) v1(68.22,334.05) v1(198.28,12.41) v1(198.65,334.04) v1(329.08,334.04)
34(A6):
  vias: v1(66.96,11.78) v1(69.11,334.69) v1(197.39,11.77) v1(199.54,334.68) v1(329.97,334.67)
35(A7):
  vias: v1(59.46,9.58) v1(76.6,336.89) v1(189.9,9.57) v1(207.03,336.88) v1(337.46,336.88)
36(A8):
  vias: v1(46.64,11.4) v1(89.43,335.07) v1(177.07,11.39) v1(219.86,335.06) v1(350.29,335.06)
37(A9):
  vias: v1(35.84,15.08) v1(100.22,331.38) v1(166.27,15.08) v1(230.65,331.37) v1(361.09,331.37)
38(A10):
  vias: v1(25.99,17.42) v1(110.07,329.05) v1(156.42,17.41) v1(240.51,329.04) v1(370.94,329.04)
IRSIGNAL_IN(6):
  vias: v1(42.82,192.83) v1(88.42,145.77) v1(173.25,192.82) v1(218.85,145.76) v1(303.68,192.82)
M1P(2):
  vias: v1(47.53,125.83) v1(177.96,125.82)
M1S(3): length 95
  Top Layer w0.254: v1(48.92,129.26) 48.92,139.93 54.26,146.15 84.77,146.15 87.41,143.35 88.42,143.35 100.36,155.93 100.49,159.1 102.39,161.01 107.47,161.01 108.88,159.6 109.19,159.6
  Bottom Layer w0.254: v1(48.92,129.26) 50.07,127.22 50.07,119.35
  vias: v1(179.35,129.25)
M2P(4): length 55.5
  Top Layer w0.254: 23.52,158.62 24.01,158.62 24.79,157.83 24.79,156.69 v1(43.08,139.29)
  Bottom Layer w0.254: v1(43.08,139.29) 49.3,139.29 51.21,137.39 51.21,127.35 52.48,126.08 52.48,119.35
  vias: v1(173.51,139.28)
M2S(5): length 59.3
  Top Layer w0.254: 23.52,158.12 23.52,155.43 39.02,140.05
  Bottom Layer w0.254: v1(38.89,140.18) 51.21,140.18 53.75,137.64 53.75,126.97 55.02,125.7 55.02,119.35
  vias: v1(169.32,140.17)
RESET:
  vias: v1(58.83,68.68) v1(77.23,277.79) v1(189.26,68.67) v1(207.67,277.78) v1(338.1,277.78)
SDA(18):
  vias: v1(67.13,123.12) v1(68.94,223.35) v1(197.56,123.11) v1(199.37,223.34) v1(329.8,223.34)
$1N12886: length 45.4
  Top Layer w1.2: v1(89.06,149.07) 88.95,166.87 90.93,169.35 74BAT1.1
  Bottom Layer w1.2: v1(89.06,149.07) 104.42,133.7 74BAT2.2
  vias: v1(219.49,149.06)
M1SLEEP(3.3V): length 3.8
  Top Layer w0.254: R77.1 106.18,158.47 109.31,158.47
M2SLEEP(3.3V): length 4.5
  Top Layer w0.254: 23.52,159.12 24.68,159.12 25.51,157.78 26.16,157.78 26.61,157.32 26.61,156.83
$1N4618: length 16
  Top Layer w0.5: 16.15,321.84 16.15,323.34 16.7,323.89 20.18,323.86 21.85,323.89 22.24,323.49 ; 146.58,321.83 146.58,323.33 147.13,323.88 150.62,323.85 152.28,323.88 152.68,323.48
$1N4662: length 7
  Top Layer w0.254: UP4.2 73.39,314.71 74.19,313.91 ; 201.45,314.7 203.82,314.7 204.62,313.9
$1N4711: length 106.2
  Top Layer w1: 29.55,212.77 34.25,208.07 44.21,208.07 46.63,205.65 46.63,182.92 52.56,176.99 54.5,176.99 ; 159.98,212.76 164.68,208.06 174.65,208.06 177.06,205.64 177.06,182.91 182.99,176.98 184.93,176.98
$1N10466: length 8.6
  Top Layer w0.8: U7.3 71.01,330.75 ; 201.44,335.04 201.44,330.74
$1N12804: length 7.9
  Top Layer w0.8: 80.17,14.27 81.89,12.54 84.85,12.54 86.64,14.34
$1N12816: length 8
  Top Layer w0.5: 113.82,22.97 114.22,22.58 115.88,22.61 119.37,22.58 119.92,23.13 119.92,24.63
$1N12824: length 7.3
  Top Layer w0.8: 124.31,27.35 128.23,27.35 130.58,29.71
$1N15829: length 7.2
  Top Layer w0.254: 111.21,158.47 117.15,158.47 118.01,157.61
$1N15830: length 7.3
  Top Layer w0.254: U25.3 112.69,158.97 113.87,160.15 118.01,160.15
$1N16024: length 4.2
  Top Layer w0.254: MOTOR2.2 18.06,160.25 19.59,160.25 20.31,159.12 U26.2
$1N16025: length 3.9
  Top Layer w0.254: MOTOR2.1 20.39,157.7 21.32,158.62 U26.3

## Copper pours and planes (outline as drawn; the poured copper is in the pictures)
GND on Bottom Layer: 255.17,350.42 400.33,350.42 400.33,168.05 255.17,168.05
GND on Bottom Layer: -5.7,350.43 139.46,350.43 139.46,168.06 -5.7,168.06
GND on Bottom Layer: 140.36,1.24 -9.62,1.24 -9.62,181.2 140.36,181.2
GND on Bottom Layer: 124.74,350.42 269.9,350.42 269.9,168.05 124.74,168.05
GND on Bottom Layer: 270.79,1.23 120.81,1.23 120.81,181.19 270.79,181.19
